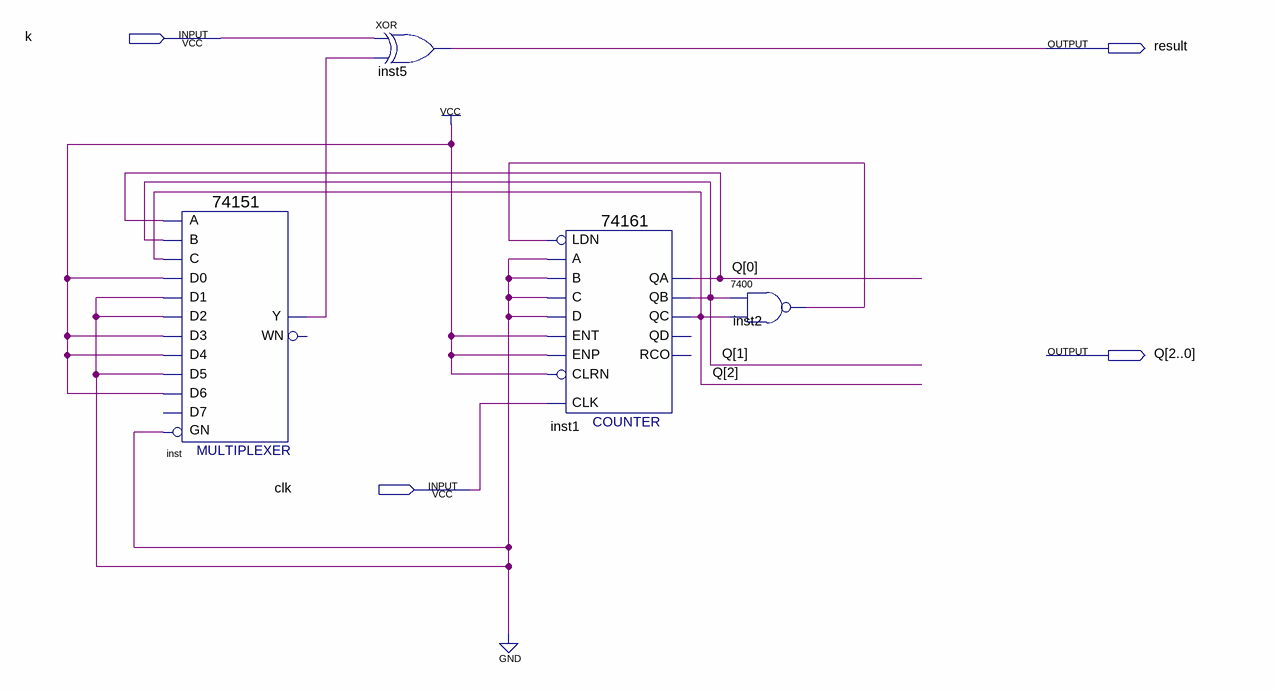
[diagram p0: schematic sheet]
// Quartus schematic xuliefashengqi.bdf as structural Verilog: 4 symbols, 4 pins
module xuliefashengqi (
  input  k,
  input  clk,
  output result,
  output [2:0] Q
);

  wire inst2_1, inst_y;

  \74151  inst (
    .GN(1'b0), .C(Q[2]), .B(Q[1]), .A(Q[0]), .D5(1'b0), .D0(1'b1), .D1(1'b0), .D4(1'b1), .D3(1'b1),
    .D2(1'b0), .D6(1'b1), .Y(inst_y));  // open: D7, WN
  xor inst5 (result, k, inst_y);
  \74161  inst1 (
    .CLRN(1'b1), .CLK(clk), .ENP(1'b1), .LDN(inst2_1), .A(1'b0), .D(1'b0), .ENT(1'b1), .B(1'b0), .C(1'b0),
    .QC(Q[2]), .QB(Q[1]), .QA(Q[0]));  // open: QD, RCO
  \7400  inst2 (.\3 (Q[2]), .\2 (Q[1]), .\1 (inst2_1));
endmodule
